# Altium schematic sheet STM32 microcontroller IOs.SchDoc: STM32 microcontroller IOs
size A3; CompanyName: STMicroelectronics; Organization: Microcontrollers Division; DocumentNumber: 4; SheetNumber: 3; SheetTotal: 19
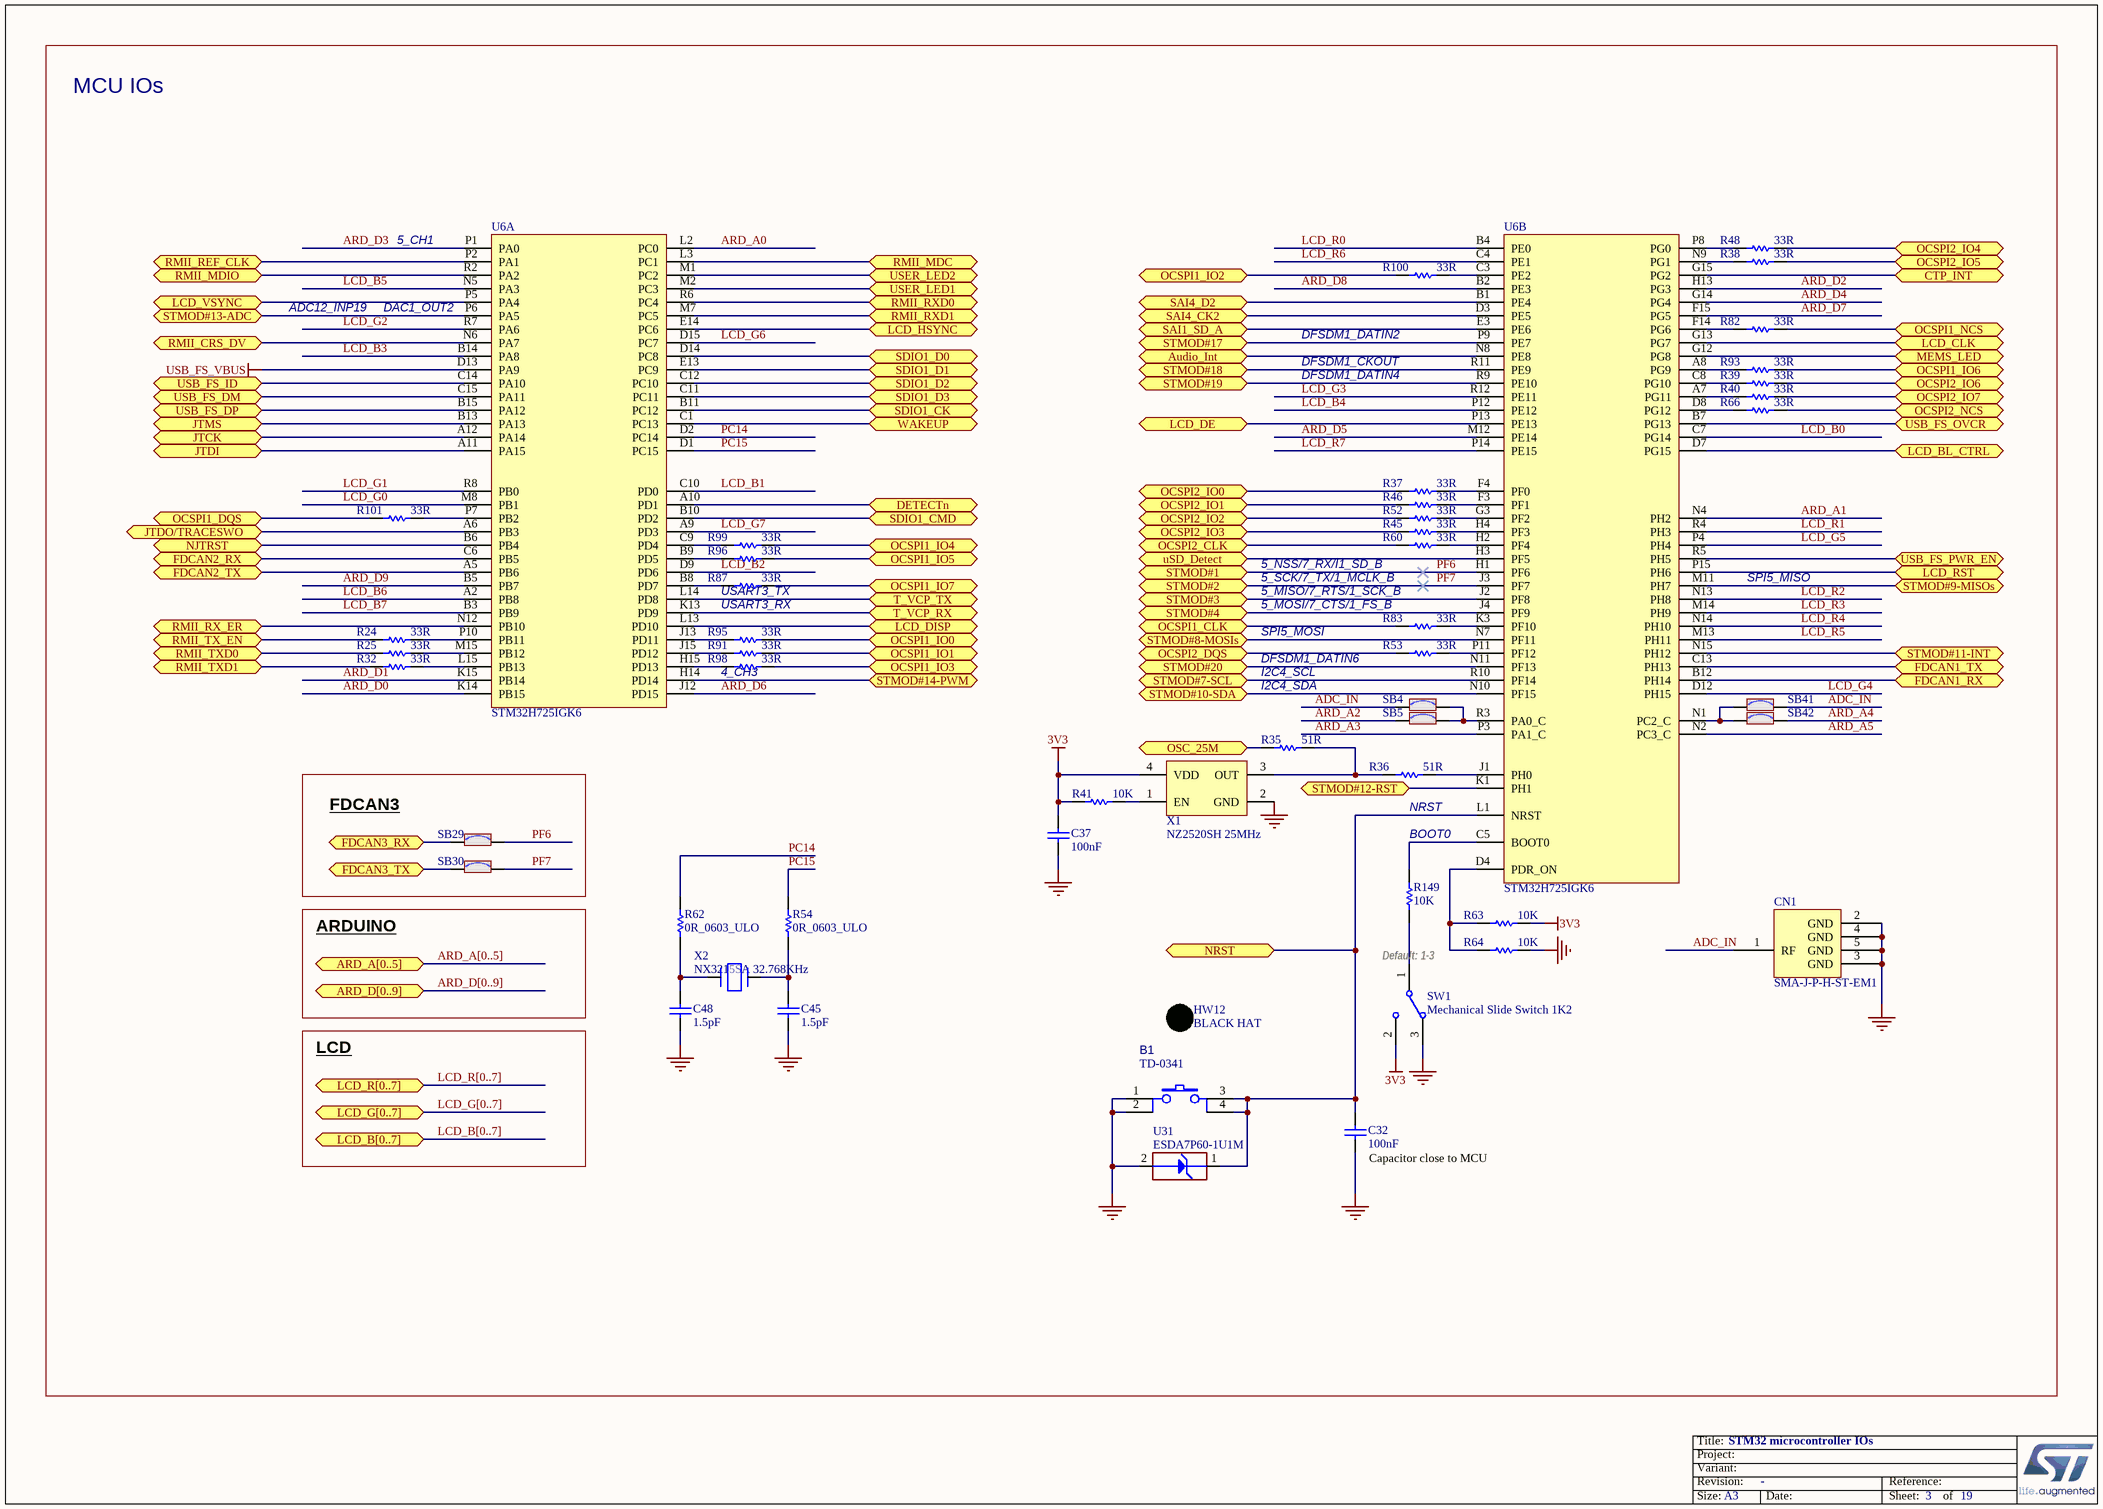
[diagram p0: STM32 microcontroller IOs.SchDoc]

## Parts
B1  Manufacturer_Part_Number: TD-0341  [SWI_WEALTHMETAL_TD-0341_4P_BLACK]  (hidden comment: SW-PUSH-CMS)
C32  value 100nF  [C0402]  (hidden comment: Capacitor)
C37  value 100nF  [C0402]  (hidden comment: Capacitor)
C45  value 1.5pF  [C0402]  (hidden comment: Capacitor)
C48  value 1.5pF  [C0402]  (hidden comment: Capacitor)
CN1  SMA-J-P-H-ST-EM1  [CON_SAMTEC_SMA-J-P-X-ST-EM1]
HW12  value BLACK HAT  (hidden comment: BUTTON_HAT_BLACK)  (mechanical)
R24  value 33R  [R0402]  (hidden comment: Resistor)
R25  value 33R  [R0402]  (hidden comment: Resistor)
R32  value 33R  [R0402]  (hidden comment: Resistor)
R35  value 51R  [R0402]  (hidden comment: Resistor)
R36  value 51R  [R0402]  (hidden comment: Resistor)
R37  value 33R  [R0402]  (hidden comment: Resistor)
R38  value 33R  [R0402]  (hidden comment: Resistor)
R39  value 33R  [R0402]  (hidden comment: Resistor)
R40  value 33R  [R0402]  (hidden comment: Resistor)
R41  value 10K  [R0402]  (hidden comment: Resistor)
R45  value 33R  [R0402]  (hidden comment: Resistor)
R46  value 33R  [R0402]  (hidden comment: Resistor)
R48  value 33R  [R0402]  (hidden comment: Resistor)
R52  value 33R  [R0402]  (hidden comment: Resistor)
R53  value 33R  [R0402]  (hidden comment: Resistor)
R54  value 0R_0603_ULO  [R0603]  (hidden comment: Resistor)
R60  value 33R  [R0402]  (hidden comment: Resistor)
R62  value 0R_0603_ULO  [R0603]  (hidden comment: Resistor)
R63  value 10K  [R0402]  (hidden comment: Resistor)
R64  value 10K  [R0402]  (hidden comment: Resistor)
R66  value 33R  [R0402]  (hidden comment: Resistor)
R82  value 33R  [R0402]  (hidden comment: Resistor)
R83  value 33R  [R0402]  (hidden comment: Resistor)
R87  value 33R  [R0402]  (hidden comment: Resistor)
R91  value 33R  [R0402]  (hidden comment: Resistor)
R93  value 33R  [R0402]  (hidden comment: Resistor)
R95  value 33R  [R0402]  (hidden comment: Resistor)
R96  value 33R  [R0402]  (hidden comment: Resistor)
R98  value 33R  [R0402]  (hidden comment: Resistor)
R99  value 33R  [R0402]  (hidden comment: Resistor)
R100  value 33R  [R0402]  (hidden comment: Resistor)
R101  value 33R  [R0402]  (hidden comment: Resistor)
R149  value 10K  [R0402]  (hidden comment: Resistor)
SB4  SB_ON  [SOLDER-BRIDGE_R0603-0R]  (value not drawn)
SB5  SB_ON  [SOLDER-BRIDGE_R0603-0R]  (value not drawn)
SB29  SB_ON  [SOLDER-BRIDGE_R0603-0R]  (value not drawn)
SB30  SB_ON  [SOLDER-BRIDGE_R0603-0R]  (value not drawn)
SB41  SB_ON  [SOLDER-BRIDGE_R0603-0R]  (value not drawn)
SB42  SB_ON  [SOLDER-BRIDGE_R0603-0R]  (value not drawn)
SW1  value Mechanical Slide Switch 1K2  [SWI_EAO_09-03290-01_EXTENDED_STRAIGHT_BLACK]  (hidden comment: SW_MECA_1K2)
U6  value STM32H725IGK6  [ICC_UFBGA201_176+25_10X10_P065]  (hidden comment: STM32H725IGK6U)  (parts A,B of 3)
U31  value ESDA7P60-1U1M  [ESD_QFN2_1P6X1_P125]  (hidden comment: ESD-TRANSIL)
X1  value NZ2520SH 25MHz  [OSC_NDK_NZ2520SB_4P]  (hidden comment: OSCILLATOR_4_PINS)
X2  value NX3215SA 32.768KHz  [CRY_NX3215SA_2P]  (hidden comment: XTAL_2_PINS)

## Blocks framed on the sheet
FDCAN3: SB29 SB30

## Ports
ARD_A[0..5], ARD_D[0..9], Audio_Int, CTP_INT, DETECTn, FDCAN1_RX, FDCAN1_TX, FDCAN2_RX, FDCAN2_TX, FDCAN3_RX, FDCAN3_TX, JTCK, JTDI, JTDO/TRACESWO, JTMS, LCD_B[0..7], LCD_BL_CTRL, LCD_CLK, LCD_DE, LCD_DISP, LCD_G[0..7], LCD_HSYNC, LCD_R[0..7], LCD_RST, LCD_VSYNC, MEMS_LED, NJTRST, NRST, OCSPI1_CLK, OCSPI1_DQS, OCSPI1_IO0, OCSPI1_IO1, OCSPI1_IO2, OCSPI1_IO3, OCSPI1_IO4, OCSPI1_IO5, OCSPI1_IO6, OCSPI1_IO7, OCSPI1_NCS, OCSPI2_CLK, OCSPI2_DQS, OCSPI2_IO0, OCSPI2_IO1, OCSPI2_IO2, OCSPI2_IO3, OCSPI2_IO4, OCSPI2_IO5, OCSPI2_IO6, OCSPI2_IO7, OCSPI2_NCS, OSC_25M, RMII_CRS_DV, RMII_MDC, RMII_MDIO, RMII_REF_CLK, RMII_RX_ER, RMII_RXD0, RMII_RXD1, RMII_TX_EN, RMII_TXD0, RMII_TXD1, SAI1_SD_A, SAI4_CK2, SAI4_D2, SDIO1_CK, SDIO1_CMD, SDIO1_D0, SDIO1_D1, SDIO1_D2, SDIO1_D3, STMOD#1, STMOD#2, STMOD#3, STMOD#4, STMOD#7-SCL, STMOD#8-MOSIs, STMOD#9-MISOs, STMOD#10-SDA, STMOD#11-INT, STMOD#12-RST, STMOD#13-ADC, STMOD#14-PWM, STMOD#17, STMOD#18, STMOD#19, STMOD#20, T_VCP_RX, T_VCP_TX, USB_FS_DM, USB_FS_DP, USB_FS_ID, USB_FS_OVCR, USB_FS_PWR_EN, uSD_Detect, USER_LED1, USER_LED2, WAKEUP

## Nets
3V3: C37.2 R41.2 R63.1 SW1.2 X1.4(VDD)
GND: B1.1 B1.2 C32.1 C37.1 C45.1 C48.1 CN1.2(GND) CN1.3(GND) CN1.4(GND) CN1.5(GND) R64.1 SW1.3 U31.2(GND) X1.2(GND)
USB_FS_VBUS: U6.D13(PA9)
ADC_IN: CN1.1(RF) SB4.1 SB41.2
ARD_A0: U6.L2(PC0)
ARD_A1: U6.N4(PH2)
ARD_A2: SB5.1
ARD_A3: U6.P3(PA1_C)
ARD_A4: SB42.2
ARD_A5: U6.N2(PC3_C)
ARD_D0: U6.K14(PB15)
ARD_D1: U6.K15(PB14)
ARD_D2: U6.H13(PG3)
ARD_D3: U6.P1(PA0)
ARD_D4: U6.G14(PG4)
ARD_D5: U6.M12(PE14)
ARD_D6: U6.J12(PD15)
ARD_D7: U6.F15(PG5)
ARD_D8: U6.B2(PE3)
ARD_D9: U6.B5(PB7)
Audio_Int: U6.N8(PE8) ; port Audio_Int
CTP_INT: U6.G15(PG2) ; port CTP_INT
DETECTn: U6.A10(PD1) ; port DETECTn
FDCAN1_RX: U6.B12(PH14) ; port FDCAN1_RX
FDCAN1_TX: U6.C13(PH13) ; port FDCAN1_TX
FDCAN2_RX: U6.C6(PB5) ; port FDCAN2_RX
FDCAN2_TX: U6.A5(PB6) ; port FDCAN2_TX
FDCAN3_RX: SB29.1 ; port FDCAN3_RX
FDCAN3_TX: SB30.1 ; port FDCAN3_TX
JTCK: U6.A12(PA14) ; port JTCK
JTDI: U6.A11(PA15) ; port JTDI
JTDO/TRACESWO: U6.A6(PB3) ; port JTDO/TRACESWO
JTMS: U6.B13(PA13) ; port JTMS
LCD_B0: U6.C7(PG14)
LCD_B1: U6.C10(PD0)
LCD_B2: U6.D9(PD6)
LCD_B3: U6.B14(PA8)
LCD_B4: U6.P12(PE12)
LCD_B5: U6.N5(PA3)
LCD_B6: U6.A2(PB8)
LCD_B7: U6.B3(PB9)
LCD_BL_CTRL: U6.D7(PG15) ; port LCD_BL_CTRL
LCD_CLK: U6.G13(PG7) ; port LCD_CLK
LCD_DE: U6.P13(PE13) ; port LCD_DE
LCD_DISP: U6.L13(PD10) ; port LCD_DISP
LCD_G0: U6.M8(PB1)
LCD_G1: U6.R8(PB0)
LCD_G2: U6.R7(PA6)
LCD_G3: U6.R12(PE11)
LCD_G4: U6.D12(PH15)
LCD_G5: U6.P4(PH4)
LCD_G6: U6.D15(PC7)
LCD_G7: U6.A9(PD3)
LCD_HSYNC: U6.E14(PC6) ; port LCD_HSYNC
LCD_R0: U6.B4(PE0)
LCD_R1: U6.R4(PH3)
LCD_R2: U6.N13(PH8)
LCD_R3: U6.M14(PH9)
LCD_R4: U6.N14(PH10)
LCD_R5: U6.M13(PH11)
LCD_R6: U6.C4(PE1)
LCD_R7: U6.P14(PE15)
LCD_RST: U6.P15(PH6) ; port LCD_RST
LCD_VSYNC: U6.P5(PA4) ; port LCD_VSYNC
MEMS_LED: U6.G12(PG8) ; port MEMS_LED
NJTRST: U6.B6(PB4) ; port NJTRST
NRST: B1.3 B1.4 C32.2 U6.L1(NRST) U31.1(IO1) ; port NRST
OCSPI1_CLK: R83.1 ; port OCSPI1_CLK
OCSPI1_DQS: R101.1 ; port OCSPI1_DQS
OCSPI1_IO0: R95.2 ; port OCSPI1_IO0
OCSPI1_IO1: R91.2 ; port OCSPI1_IO1
OCSPI1_IO2: R100.1 ; port OCSPI1_IO2
OCSPI1_IO3: R98.2 ; port OCSPI1_IO3
OCSPI1_IO4: R99.2 ; port OCSPI1_IO4
OCSPI1_IO5: R96.2 ; port OCSPI1_IO5
OCSPI1_IO6: R93.2 ; port OCSPI1_IO6
OCSPI1_IO7: R87.2 ; port OCSPI1_IO7
OCSPI1_NCS: R82.2 ; port OCSPI1_NCS
OCSPI2_CLK: R60.1 ; port OCSPI2_CLK
OCSPI2_DQS: R53.1 ; port OCSPI2_DQS
OCSPI2_IO0: R37.1 ; port OCSPI2_IO0
OCSPI2_IO1: R46.1 ; port OCSPI2_IO1
OCSPI2_IO2: R52.1 ; port OCSPI2_IO2
OCSPI2_IO3: R45.1 ; port OCSPI2_IO3
OCSPI2_IO4: R48.2 ; port OCSPI2_IO4
OCSPI2_IO5: R38.2 ; port OCSPI2_IO5
OCSPI2_IO6: R39.2 ; port OCSPI2_IO6
OCSPI2_IO7: R40.2 ; port OCSPI2_IO7
OCSPI2_NCS: R66.2 ; port OCSPI2_NCS
OSC_25M: R35.1 ; port OSC_25M
PC14: R62.1 U6.D2(PC14)
PC15: R54.1 U6.D1(PC15)
PF6: SB29.2 U6.H1(PF6) ; port STMOD#1
PF7: SB30.2 U6.J3(PF7) ; port STMOD#2
RMII_CRS_DV: U6.N6(PA7) ; port RMII_CRS_DV
RMII_MDC: U6.L3(PC1) ; port RMII_MDC
RMII_MDIO: U6.R2(PA2) ; port RMII_MDIO
RMII_REF_CLK: U6.P2(PA1) ; port RMII_REF_CLK
RMII_RX_ER: U6.N12(PB10) ; port RMII_RX_ER
RMII_RXD0: U6.R6(PC4) ; port RMII_RXD0
RMII_RXD1: U6.M7(PC5) ; port RMII_RXD1
RMII_TX_EN: R24.1 ; port RMII_TX_EN
RMII_TXD0: R25.1 ; port RMII_TXD0
RMII_TXD1: R32.1 ; port RMII_TXD1
SAI1_SD_A: U6.E3(PE6) ; port SAI1_SD_A
SAI4_CK2: U6.D3(PE5) ; port SAI4_CK2
SAI4_D2: U6.B1(PE4) ; port SAI4_D2
SDIO1_CK: U6.B11(PC12) ; port SDIO1_CK
SDIO1_CMD: U6.B10(PD2) ; port SDIO1_CMD
SDIO1_D0: U6.D14(PC8) ; port SDIO1_D0
SDIO1_D1: U6.E13(PC9) ; port SDIO1_D1
SDIO1_D2: U6.C12(PC10) ; port SDIO1_D2
SDIO1_D3: U6.C11(PC11) ; port SDIO1_D3
STMOD#3: U6.J2(PF8) ; port STMOD#3
STMOD#4: U6.J4(PF9) ; port STMOD#4
STMOD#7-SCL: U6.R10(PF14) ; port STMOD#7-SCL
STMOD#8-MOSIs: U6.N7(PF11) ; port STMOD#8-MOSIs
STMOD#9-MISOs: U6.M11(PH7) ; port STMOD#9-MISOs
STMOD#10-SDA: U6.N10(PF15) ; port STMOD#10-SDA
STMOD#11-INT: U6.N15(PH12) ; port STMOD#11-INT
STMOD#12-RST: U6.K1(PH1) ; port STMOD#12-RST
STMOD#13-ADC: U6.P6(PA5) ; port STMOD#13-ADC
STMOD#14-PWM: U6.H14(PD14) ; port STMOD#14-PWM
STMOD#17: U6.P9(PE7) ; port STMOD#17
STMOD#18: U6.R11(PE9) ; port STMOD#18
STMOD#19: U6.R9(PE10) ; port STMOD#19
STMOD#20: U6.N11(PF13) ; port STMOD#20
T_VCP_RX: U6.K13(PD9) ; port T_VCP_RX
T_VCP_TX: U6.L14(PD8) ; port T_VCP_TX
USB_FS_DM: U6.C15(PA11) ; port USB_FS_DM
USB_FS_DP: U6.B15(PA12) ; port USB_FS_DP
USB_FS_ID: U6.C14(PA10) ; port USB_FS_ID
USB_FS_OVCR: U6.B7(PG13) ; port USB_FS_OVCR
USB_FS_PWR_EN: U6.R5(PH5) ; port USB_FS_PWR_EN
uSD_Detect: U6.H3(PF5) ; port uSD_Detect
USER_LED1: U6.M2(PC3) ; port USER_LED1
USER_LED2: U6.M1(PC2) ; port USER_LED2
WAKEUP: U6.C1(PC13) ; port WAKEUP
NetC45_2: C45.2 R54.2 X2.1(X1)
NetC48_2: C48.2 R62.2 X2.2(X2)
NetR24_2: R24.2 U6.P10(PB11)
NetR25_2: R25.2 U6.M15(PB12)
NetR32_2: R32.2 U6.L15(PB13)
NetR35_2: R35.2 R36.1 X1.3(OUT)
NetR36_2: R36.2 U6.J1(PH0)
NetR37_2: R37.2 U6.F4(PF0)
NetR38_1: R38.1 U6.N9(PG1)
NetR39_1: R39.1 U6.C8(PG10)
NetR40_1: R40.1 U6.A7(PG11)
NetR41_1: R41.1 X1.1(EN)
NetR45_2: R45.2 U6.H4(PF3)
NetR46_2: R46.2 U6.F3(PF1)
NetR48_1: R48.1 U6.P8(PG0)
NetR52_2: R52.2 U6.G3(PF2)
NetR53_2: R53.2 U6.P11(PF12)
NetR60_2: R60.2 U6.H2(PF4)
NetR63_2: R63.2 R64.2 U6.D4(PDR_ON)
NetR66_1: R66.1 U6.D8(PG12)
NetR82_1: R82.1 U6.F14(PG6)
NetR83_2: R83.2 U6.K3(PF10)
NetR87_1: R87.1 U6.B8(PD7)
NetR91_1: R91.1 U6.J15(PD12)
NetR93_1: R93.1 U6.A8(PG9)
NetR95_1: R95.1 U6.J13(PD11)
NetR96_1: R96.1 U6.B9(PD5)
NetR98_1: R98.1 U6.H15(PD13)
NetR99_1: R99.1 U6.C9(PD4)
NetR100_2: R100.2 U6.C3(PE2)
NetR101_2: R101.2 U6.P7(PB2)
NetR149_1: R149.1 U6.C5(BOOT0)
NetR149_2: R149.2 SW1.1
NetSB4_2: SB4.2 SB5.2 U6.R3(PA0_C)
NetSB41_1: SB41.1 SB42.1 U6.N1(PC2_C)

## Buses and harness runs
bus ARD_A[0..5] = port ARD_A[0..5]
bus ARD_D[0..9] = port ARD_D[0..9]
bus LCD_B[0..7] = port LCD_B[0..7]
bus LCD_G[0..7] = port LCD_G[0..7]
bus LCD_R[0..7] = port LCD_R[0..7]

## Notes on the sheet
- MCU IOs
- 5_CH1
- ADC12_INP19
- (near U6) DAC1_OUT2
- DFSDM1_DATIN2
- DFSDM1_CKOUT
- DFSDM1_DATIN4
- 5_NSS/7_RX/I1_SD_B
- 5_SCK/7_TX/1_MCLK_B
- SPI5_MISO
- (near R87) USART3_TX
- (near R87) USART3_RX
- 5_MISO/7_RTS/1_SCK_B
- 5_MOSI/7_CTS/1_FS_B
- SPI5_MOSI
- (near R98) 4_CH3
- DFSDM1_DATIN6
- I2C4_SDA
- I2C4_SCL
- BOOT0
- (near R36) NRST
- ARDUINO
- Default: 1-3
- LCD
- (near C32) Capacitor close to MCU
- Title:
- Project:
- Size:
- Revision:
- Variant:
- A3
- -
- Date:
- Reference:
- Sheet:
- of

## Library data of the parts
B1 = MCD-00001: Non-Open Push-Button 0.1A 24V BLACK; Part_Type: Misc; Manufacturer: WEALTHMETAL; Value: SWITCH; Provided_By: SUBCO; Internal_Part_Number: MCD-00001; Status: Released; ComponentLink1Description: Datasheet; ComponentLink1URL: http://tunmcdsvn.tun.st.com/Component_Datasheet_Library/Trunk/Misc/Wealthmetal_Tact-Switch_TD0341
C32 C37 = MCD-00102: Capacitor, MLCC, 100nF, 16V, X7R, 10%, 0402, T=0,5mm; Manufacturer_Part_Number: CC0402KRX7R7BB104; Manufacturer: YAGEO; Alternate_Manufacturer_Part_Number: GCM155R71C104KA55D; Alternate_Manufacturer: MURATA; Provided_By: SUBCO; Internal_Part_Number: MCD-00102; Status: Released; Part_Type: Capacitor; Package: C0402; ComponentLink1Description: Datasheet; ComponentLink1URL: http://tunmcdsvn.tun.st.com/Component_Datasheet_Library/Trunk/Capacitors/Yageo_Multilayer_Capacitor_X7R_series_100pF_to_22uF
C45 C48 = MCD-00563: Capacitor, MLCC, 1.5pF, 50V, NPO, +-0.25pF, 0402, T=0,5mm; Manufacturer_Part_Number: CC0402CRNPO9BN1R5; Manufacturer: YAGEO; Provided_By: SUBCO; Internal_Part_Number: MCD-00563; Status: Released; Part_Type: Capacitor; Package: C0402; ComponentLink1Description: Datasheet; ComponentLink1URL: http://tunmcdsvn.tun.st.com/Component_Datasheet_Library/Trunk/Capacitors/Yageo_Capacitor_NP0_16V-to-50V
CN1 = MCD-00279: RF SMA connector PCB edge; Manufacturer: SAMTEC; ECCN_US: EAR99; ECCN_EU: NEC; Provided_By: SUBCO; Internal_Part_Number: MCD-00279; Value: SMA-J-P-H-ST-EM1; Status: Released; Part_Type: Connector; Manufacturer_Part_Number: SMA-J-P-H-ST-EM1; ComponentLink1Description: Datasheet; ComponentLink1URL: http://tunmcdsvn.tun.st.com/Component_Datasheet_Library/Trunk/Connectors/Samtec_sma_SMA_series
HW12 = MCD-00635: Black Hat for switch TD0341X-G01-BLA; Part_Type: Mechanical; Manufacturer_Part_Number: 988.16.09.3.00003_SH-517; Manufacturer: JIUBABA; Provided_By: SUBCO; Internal_Part_Number: MCD-00635; Status: Released; ComponentLink1Description: Datasheet; ComponentLink1URL: http://tunmcdsvn.tun.st.com/Component_Datasheet_Library/Trunk/Mechanical/Jiubaba_HAT_SH-517
R24 R25 R32 R37-R40 R45 R46 R48 R52 R53 R60 R66 R82 R83 R87 R91 R93 R95 R96 R98-R101 = MCD-00455: Resistor,33R,0402,1%,1/16W; Manufacturer_Part_Number: RC0402FR-0733RL; Manufacturer: YAGEO; Provided_By: SUBCO; Internal_Part_Number: MCD-00455; Status: Released; Part_Type: Resistor; Package: R0402; ComponentLink1Description: Datasheet; ComponentLink1URL: http://tunmcdsvn.tun.st.com/Component_Datasheet_Library/Trunk/Resistors/Yageo_Resistor_RC0402-series
R35 R36 = MCD-00485: Resistor,51R,0402,1%,1/16W; Manufacturer_Part_Number: RC0402FR-0751RL; Manufacturer: YAGEO; Provided_By: SUBCO; Internal_Part_Number: MCD-00485; Status: Released; Part_Type: Resistor; Package: R0402; ComponentLink1Description: Datasheet; ComponentLink1URL: http://tunmcdsvn.tun.st.com/Component_Datasheet_Library/Trunk/Resistors/Yageo_Resistor_RC0402-series
R41 R63 R64 R149 = MCD-00053: Resistor,10K,0402,1%,1/16W; Manufacturer_Part_Number: RC0402FR-0710KL; Manufacturer: YAGEO; Provided_By: SUBCO; Internal_Part_Number: MCD-00053; Status: Released; Part_Type: Resistor; Package: R0402; ComponentLink1Description: Datasheet; ComponentLink1URL: http://tunmcdsvn.tun.st.com/Component_Datasheet_Library/Trunk/Resistors/Yageo_Resistor_RC0402-series
R54 R62 = MCD-00181: Resistor,0R,0603,ULO; Manufacturer_Part_Number: PMR03EZPJ000; Manufacturer: ROHM; Provided_By: SUBCO; Internal_Part_Number: MCD-00181; Status: Released; Part_Type: Resistor; Package: R0603; ComponentLink1Description: Datasheet; ComponentLink1URL: http://tunmcdsvn.tun.st.com/Component_Datasheet_Library/Trunk/Resistors/ROHM_ULtra_low_Ohmic_Resistor_PMR10EZPJ000
SB4 SB5 SB29 SB30 SB41 SB42 = MCD-00071: Solder Bridge ON; Part_Type: Mechanical; Manufacturer_Part_Number: RC0603JR-070RL; Manufacturer: YAGEO; Provided_By: SUBCO; Internal_Part_Number: MCD-00071; Status: Released; Package: SB0603; ComponentLink1Description: Datasheet; ComponentLink1URL: http://tunmcdsvn.tun.st.com/Component_Datasheet_Library/Trunk/Resistors/Yageo_Resistor_RC0603-series
SW1 = MCD-00566: Mechanical Slide Switches 1K2 BLK ACT GOLD STRT MNT; Part_Type: Misc; Manufacturer_Part_Number: 09.03290.01; Manufacturer: EAO; Provided_By: SUBCO; Internal_Part_Number: MCD-00566; Status: Checked; ComponentLink1Description: Datasheet; ComponentLink1URL: http://tunmcdsvn.tun.st.com/Component_Datasheet_Library/Trunk/Misc/EAO_SWITCH_09.03290.01; ECCN_US: n/a; ECCN_EU: n/a
U6 = MCD-01673: STM32H725IGK6 MCU, Cut1.0, 10x10x0.6mm, Pitch0.65mm, Int SMPS; Part_Type: IC; Manufacturer: STMICROELECTRONICS; ECCN_US: 3A991A2; ECCN_EU: NEC; Provided_By: SUBCO with ST control; Internal_Part_Number: MCD-01673; Status: Checked; Manufacturer_Part_Number: STM32H725IGK6; Package: UFBGA176+25; ComponentLink1Description: Datasheet; ComponentLink1URL: http://tunmcdsvn.tun.st.com/Component_Datasheet_Library/Trunk/IC/STM_MCU_STM32H725IGK6U_UFBGA176
U31 = MCD-00251: High power transient voltage suppressor, 7V breakdown; Part_Type: Diode; Manufacturer: STMICROELECTRONICS; BMS_Part_Number: 9179042; Provided_By: SUBCO with ST control; Internal_Part_Number: MCD-00251; Status: Released; Manufacturer_Part_Number: ESDA7P60-1U1M; ComponentLink1Description: Datasheet; ComponentLink1URL: http://tunmcdsvn.tun.st.com/Component_Datasheet_Library/Trunk/Diodes/STM_ESD_ESDA7P60-1U1M
X1 = MCD-00597: Oscillator 25Mhz, +-50ppm, Vcc:3.3V typ, square wave: [0.1Vcc;0.9Vcc], Enable pin, SMD; Part_Type: Crystal_Osc; Manufacturer_Part_Number: NZ2520SH 25MHz END4869C; Manufacturer: NDK; Alternate_Manufacturer_Part_Number: NZ2520SB 25MHz END4869B; BMS_Part_Number: 9157050; Provided_By: SUBCO; Internal_Part_Number: MCD-00597; Status: Released; Alternate_Manufacturer: NDK; ComponentLink1Description: Datasheet; ComponentLink1URL: http://tunmcdsvn.tun.st.com/Component_Datasheet_Library/Trunk/Crystal_Osc/NDK_NZ2520SH 25MHz END4869C
X2 = MCD-00091: Crystal 32.768kHz, 6pF, +-20ppm, 50Kohms max, SMD; Part_Type: Crystal_Osc; Manufacturer_Part_Number: NX3215SA 32.768KHz EXS00A-MU00525; Manufacturer: NDK; BMS_Part_Number: 9157034; Provided_By: SUBCO; Internal_Part_Number: MCD-00091; Status: Released; ComponentLink1Description: Datasheet; ComponentLink1URL: http://tunmcdsvn.tun.st.com/Component_Datasheet_Library/Trunk/Crystal_Osc/NDK_Crystal-For-ST_NX3215SA 32.768KHz EXS00A-MU00525 (EXS10B-21238); Order_Code_Digikey: 644-1386